# EAGLE schematic Arduino MEGA DRAM Tester (EAGLE 9.5.0)
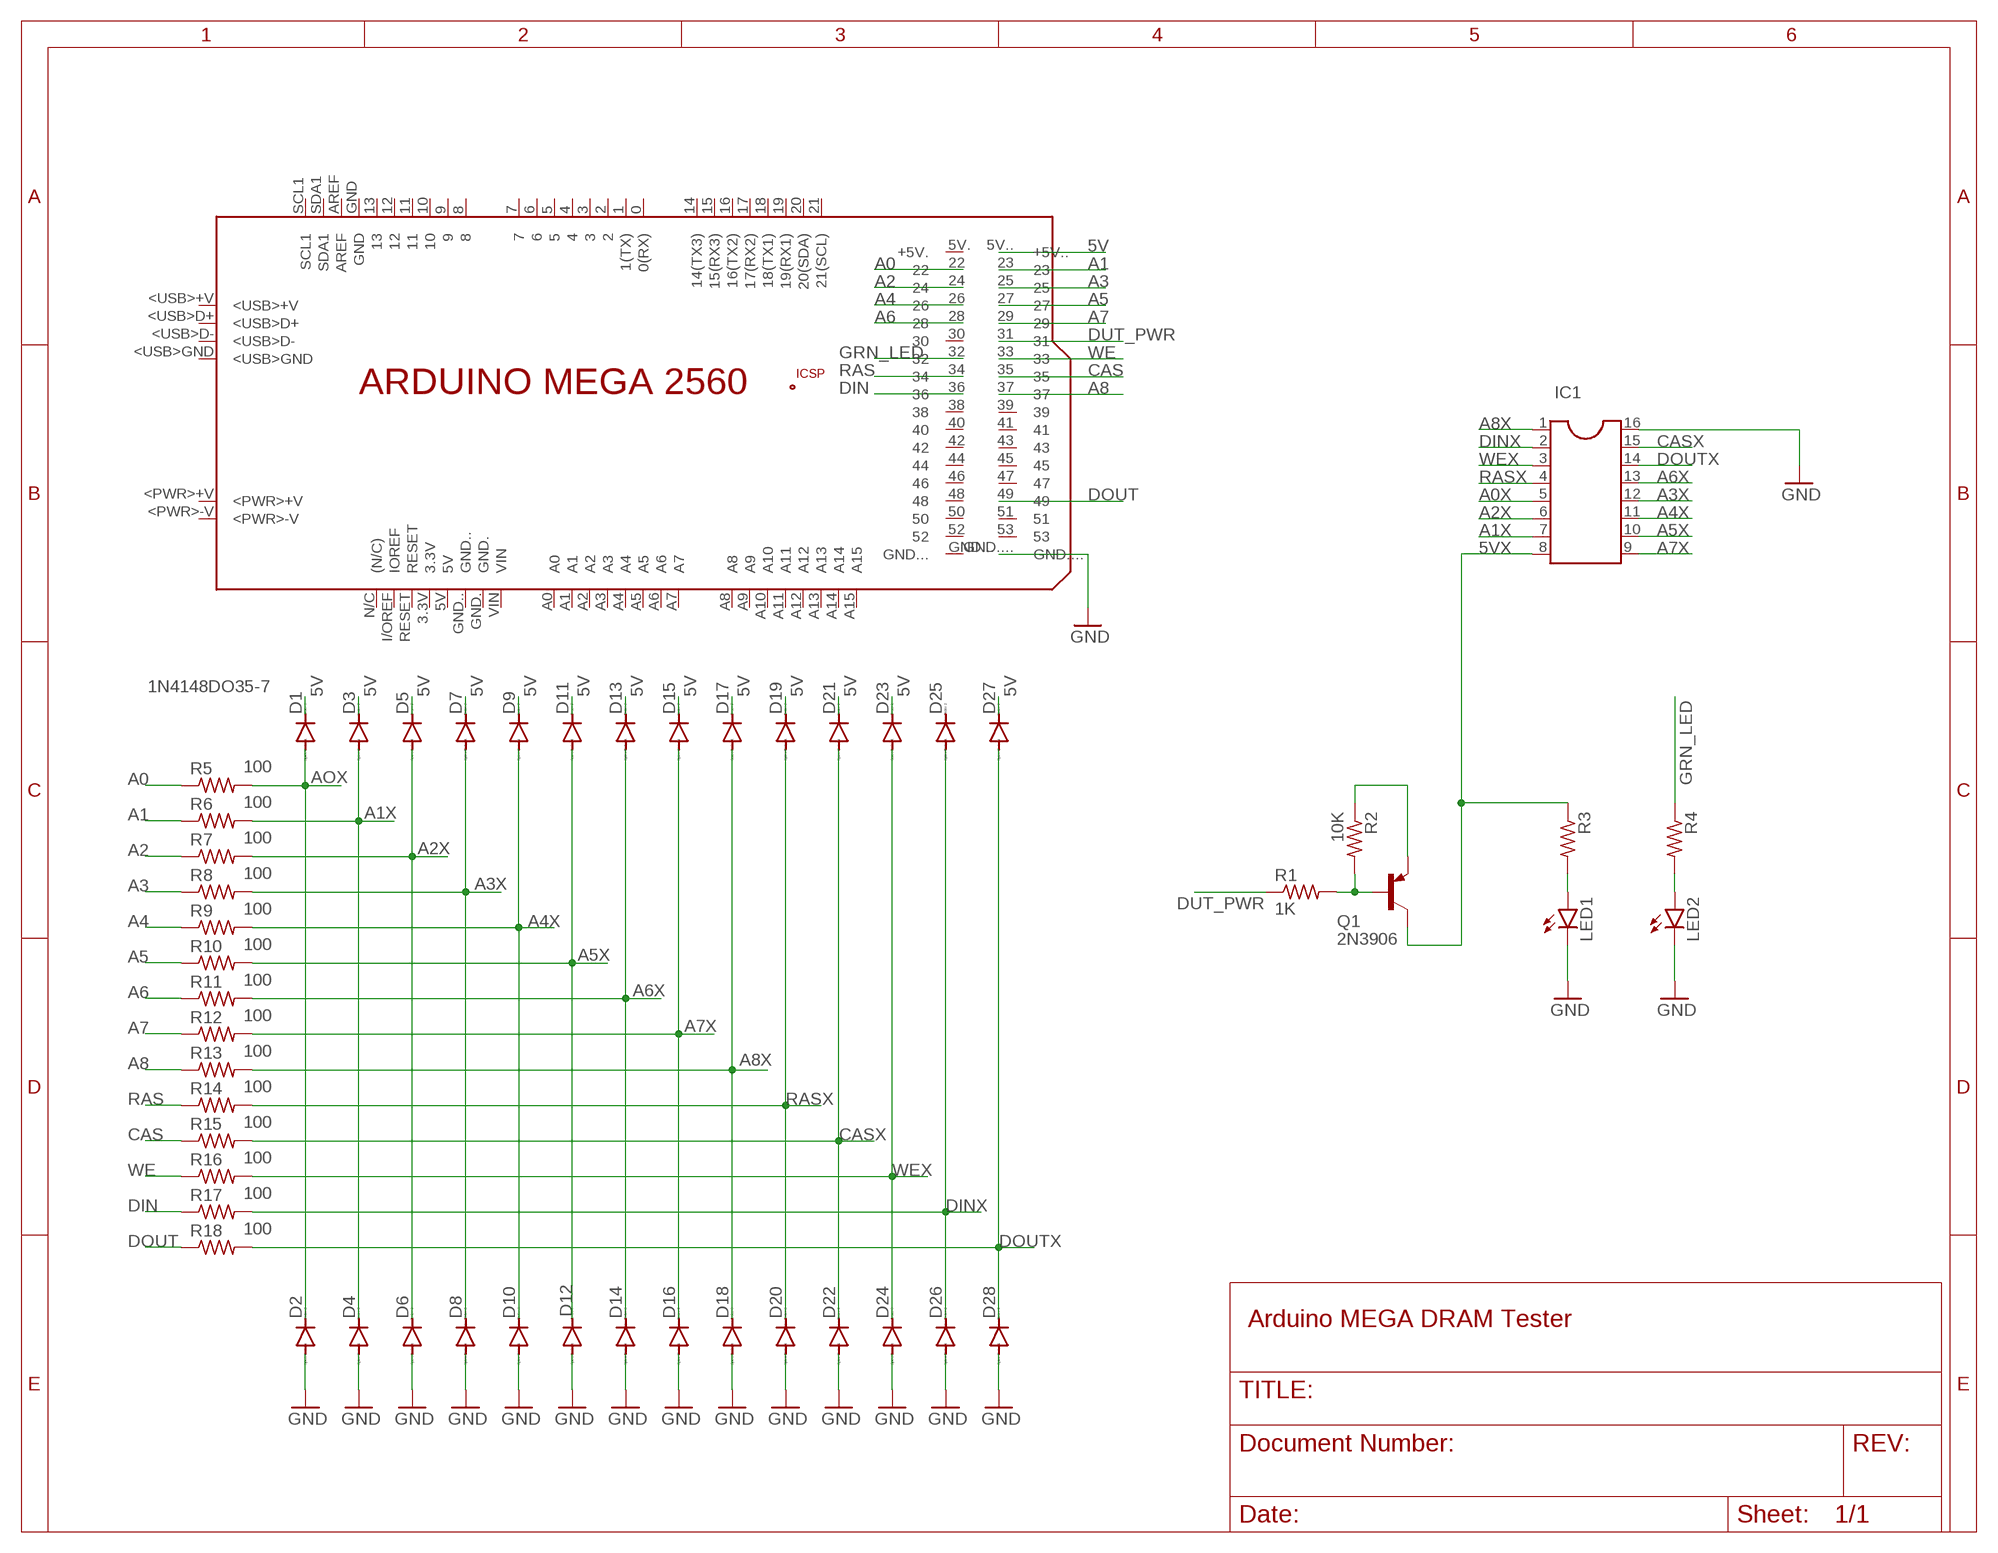
[diagram p0: schematic, sheet 1]

## Parts
D1  1N4148DO35-7  [DO35-7]
D2  1N4148DO35-7  [DO35-7]
D3  1N4148DO35-7  [DO35-7]
D4  1N4148DO35-7  [DO35-7]
D5  1N4148DO35-7  [DO35-7]
D6  1N4148DO35-7  [DO35-7]
D7  1N4148DO35-7  [DO35-7]
D8  1N4148DO35-7  [DO35-7]
D9  1N4148DO35-7  [DO35-7]
D10  1N4148DO35-7  [DO35-7]
D11  1N4148DO35-7  [DO35-7]
D12  1N4148DO35-7  [DO35-7]
D13  1N4148DO35-7  [DO35-7]
D14  1N4148DO35-7  [DO35-7]
D15  1N4148DO35-7  [DO35-7]
D16  1N4148DO35-7  [DO35-7]
D17  1N4148DO35-7  [DO35-7]
D18  1N4148DO35-7  [DO35-7]
D19  1N4148DO35-7  [DO35-7]
D20  1N4148DO35-7  [DO35-7]
D21  1N4148DO35-7  [DO35-7]
D22  1N4148DO35-7  [DO35-7]
D23  1N4148DO35-7  [DO35-7]
D24  1N4148DO35-7  [DO35-7]
D25  1N4148DO35-7  [DO35-7]
D26  1N4148DO35-7  [DO35-7]
D27  1N4148DO35-7  [DO35-7]
D28  1N4148DO35-7  [DO35-7]
IC1  DIL16  [DIL16]
LED1  LED5MM  [LED5MM]
LED2  LED5MM  [LED5MM]
PCB1  ARDUINO_MEGA2560  [ARDUINO_MEGA2560]
Q1  2N3906  [TO92]
R1  1K  R-US_0309/10  [0309/10]
R2  10K  R-US_0309/10  [0309/10]
R3  R-US_0309/10  [0309/10]
R4  R-US_0309/10  [0309/10]
R5  100  R-US_0309/10  [0309/10]
R6  100  R-US_0309/10  [0309/10]
R7  100  R-US_0309/10  [0309/10]
R8  100  R-US_0309/10  [0309/10]
R9  100  R-US_0309/10  [0309/10]
R10  100  R-US_0309/10  [0309/10]
R11  100  R-US_0309/10  [0309/10]
R12  100  R-US_0309/10  [0309/10]
R13  100  R-US_0309/10  [0309/10]
R14  100  R-US_0309/10  [0309/10]
R15  100  R-US_0309/10  [0309/10]
R16  100  R-US_0309/10  [0309/10]
R17  100  R-US_0309/10  [0309/10]
R18  100  R-US_0309/10  [0309/10]

## Nets
5V: D1.C D3.C D5.C D7.C D9.C D11.C D13.C D15.C D17.C D19.C D21.C D23.C D27.C PCB1.5V..(+5V..)
5VX: IC1.8 Q1.1(C) R3.1
A0: PCB1.22 R5.1
A0X: IC1.5
A1: PCB1.23 R6.1
A1X: D3.A D4.C IC1.7 R6.2
A2: PCB1.24 R7.1
A2X: D5.A D6.C IC1.6 R7.2
A3: PCB1.25 R8.1
A3X: D7.A D8.C IC1.12 R8.2
A4: PCB1.26 R9.1
A4X: D9.A D10.C IC1.11 R9.2
A5: PCB1.27 R10.1
A5X: D11.A D12.C IC1.10 R10.2
A6: PCB1.28 R11.1
A6X: D13.A D14.C IC1.13 R11.2
A7: PCB1.29 R12.1
A7X: D15.A D16.C IC1.9 R12.2
A8: PCB1.37 R13.1
A8X: D17.A D18.C IC1.1 R13.2
A8X1: D19.A
AOX: D1.A D2.C R5.2
CAS: PCB1.35 R15.1
CASX: D21.A D22.C IC1.15 R15.2
DIN: PCB1.36 R17.1
DINX: D25.A D26.C IC1.2 R17.2
DOUT: PCB1.49 R18.1
DOUTX: D27.A D28.C IC1.14 R18.2
DUT_PWR: PCB1.31 R1.1
GND: D2.A D4.A D6.A D8.A D10.A D12.A D14.A D16.A D18.A D20.A D22.A D24.A D26.A D28.A IC1.16 LED1.K(C) LED2.K(C) PCB1.GND....
GRN_LED: PCB1.32 R4.1
N$6: LED1.A R3.2
N$7: Q1.2(B) R1.2 R2.2
N$17: Q1.3(E) R2.1
N$20: LED2.A R4.2
RAS: PCB1.34 R14.1
RASX: D20.C IC1.4 R14.2
WE: PCB1.33 R16.1
WEX: D23.A D24.C IC1.3 R16.2
Unconnected: D25.C PCB1.0(0(RX)) PCB1.1(1(TX)) PCB1.2 PCB1.3 PCB1.3.3V PCB1.4 PCB1.5 PCB1.5V PCB1.5V.(+5V.) PCB1.6 PCB1.7 PCB1.8 PCB1.9 PCB1.10 PCB1.11 PCB1.12 PCB1.13 PCB1.14(14(TX3)) PCB1.15(15(RX3)) PCB1.16(16(TX2)) PCB1.17(17(RX2)) PCB1.18(18(TX1)) PCB1.19(19(RX1)) PCB1.20(20(SDA)) PCB1.21(21(SCL)) PCB1.30 PCB1.38 PCB1.39 PCB1.40 PCB1.41 PCB1.42 PCB1.43 PCB1.44 PCB1.45 PCB1.46 PCB1.47 PCB1.48 PCB1.50 PCB1.51 PCB1.52 PCB1.53 PCB1.+5V_ PCB1.<PWR>+V PCB1.<PWR>-V PCB1.<USB>+V PCB1.<USB>D+ PCB1.<USB>D- PCB1.<USB>GND PCB1.A0 PCB1.A1 PCB1.A2 PCB1.A3 PCB1.A4 PCB1.A5 PCB1.A6 PCB1.A7 PCB1.A8 PCB1.A9 PCB1.A10 PCB1.A11 PCB1.A12 PCB1.A13 PCB1.A14 PCB1.A15 PCB1.AREF PCB1.GND PCB1.GND. PCB1.GND.. PCB1.GND... PCB1.GND__ PCB1.I/OREF(IOREF) PCB1.MISO PCB1.MOSI PCB1.N/C((N/C)) PCB1.RESET PCB1.RESET. PCB1.SCK PCB1.SCL1 PCB1.SDA1 PCB1.VIN

## Library data of the parts
D1-D28 = diode:1N4148: DIODE high speed (Philips)
IC1 = ic-package:DIL16: Dual In Line / Socket
LED1 LED2 = led:LED: LED OSRAM: - CHIPLED LG R971, LG N971, LY N971, LG Q971, LY Q971, LO R971, LY R971 LH N974, LH R974 LS Q976, LO Q976, LY Q976 LO Q996 - Hyper CHIPLED LW Q18S LB Q993, LB Q99A, LB R99A - SideLED LS A670, LO A670, LY A670, LG A670, LP A670 LB A673, LV A673, LT A673, LW A673 LH A674 LY A675 LS A676, LA A676, LO A676, LY A676, LW A676 LS A679, LY A679, LG A679 - Hyper Micro SIDELED® LS Y876, LA Y876, LO Y876, LY Y876 LT Y87S - SmartLED LW L88C, LW L88S LB L89C, LB L89S, LG L890 LS L89K, LO L89K, LY L89K LS L896, LA L896, LO L896, LY L896 - TOPLED LS T670, LO T670, LY T670, LG T670, LP T670 LSG T670, LSP T670, LSY T670, LOP T670, LYG T670 LG T671, LOG T671, LSG T671 LB T673, LV T673, LT T673, LW T673 LH T674 LS T676, LA T676, LO T676, LY T676, LB T676, LH T676, LSB T676, LW T676 LB T67C, LV T67C, LT T67C, LS T67K, LO T67K, LY T67K, LW E67C LS E67B, LA E67B, LO E67B, LY E67B, LB E67C, LV E67C, LT E67C LW T67C LS T679, LY T679, LG T679 LS T770, LO T770, LY T770, LG T770, LP T770 LB T773, LV T773, LT T773, LW T773 LH T774 LS E675, LA E675, LY E675, LS T675 LS T776, LA T776, LO T776, LY T776, LB T776 LHGB T686 LT T68C, LB T68C - Hyper Mini TOPLED® LB M676 - Mini TOPLED Santana® LG M470 LS M47K, LO M47K, LY M47K Source: http://www.osram.convergy.de LUXEON: - LUMILED® LXK2-PW12-R00, LXK2-PW12-S00, LXK2-PW14-U00, LXK2-PW14-V00 LXK2-PM12-R00, LXK2-PM12-S00, LXK2-PM14-U00 LXK2-PE12-Q00, LXK2-PE12-R00, LXK2-PE12-S00, LXK2-PE14-T00, LXK2-PE14-U00 LXK2-PB12-K00, LXK2-PB12-L00, LXK2-PB12-M00, LXK2-PB14-N00, LXK2-PB14-P00, LXK2-PB14-Q00 LXK2-PR12-L00, LXK2-PR12-M00, LXK2-PR14-Q00, LXK2-PR14-R00 LXK2-PD12-Q00, LXK2-PD12-R00, LXK2-PD12-S00 LXK2-PH12-R00, LXK2-PH12-S00 LXK2-PL12-P00, LXK2-PL12-Q00, LXK2-PL12-R00 Source: www.luxeon.com KINGBRIGHT: KA-3528ASYC Source: www.kingbright.com
PCB1 = E14_Arduino_revC:ARDUINO_MEGA2560: Device for representing an Arduino Mega 2560 board with a footprint in an EAGLE design. Created by Dave Young for Element14. More EAGLE documentation at: http://www.element14.com/community/community/knode/cadsoft_eagle
Q1 = transistor-pnp:2N3906: PNP Transistor
R1-R18 = resistor:R-US_: RESISTOR, American symbol